# Altium schematic sheet 4USB.SchDoc
size A2
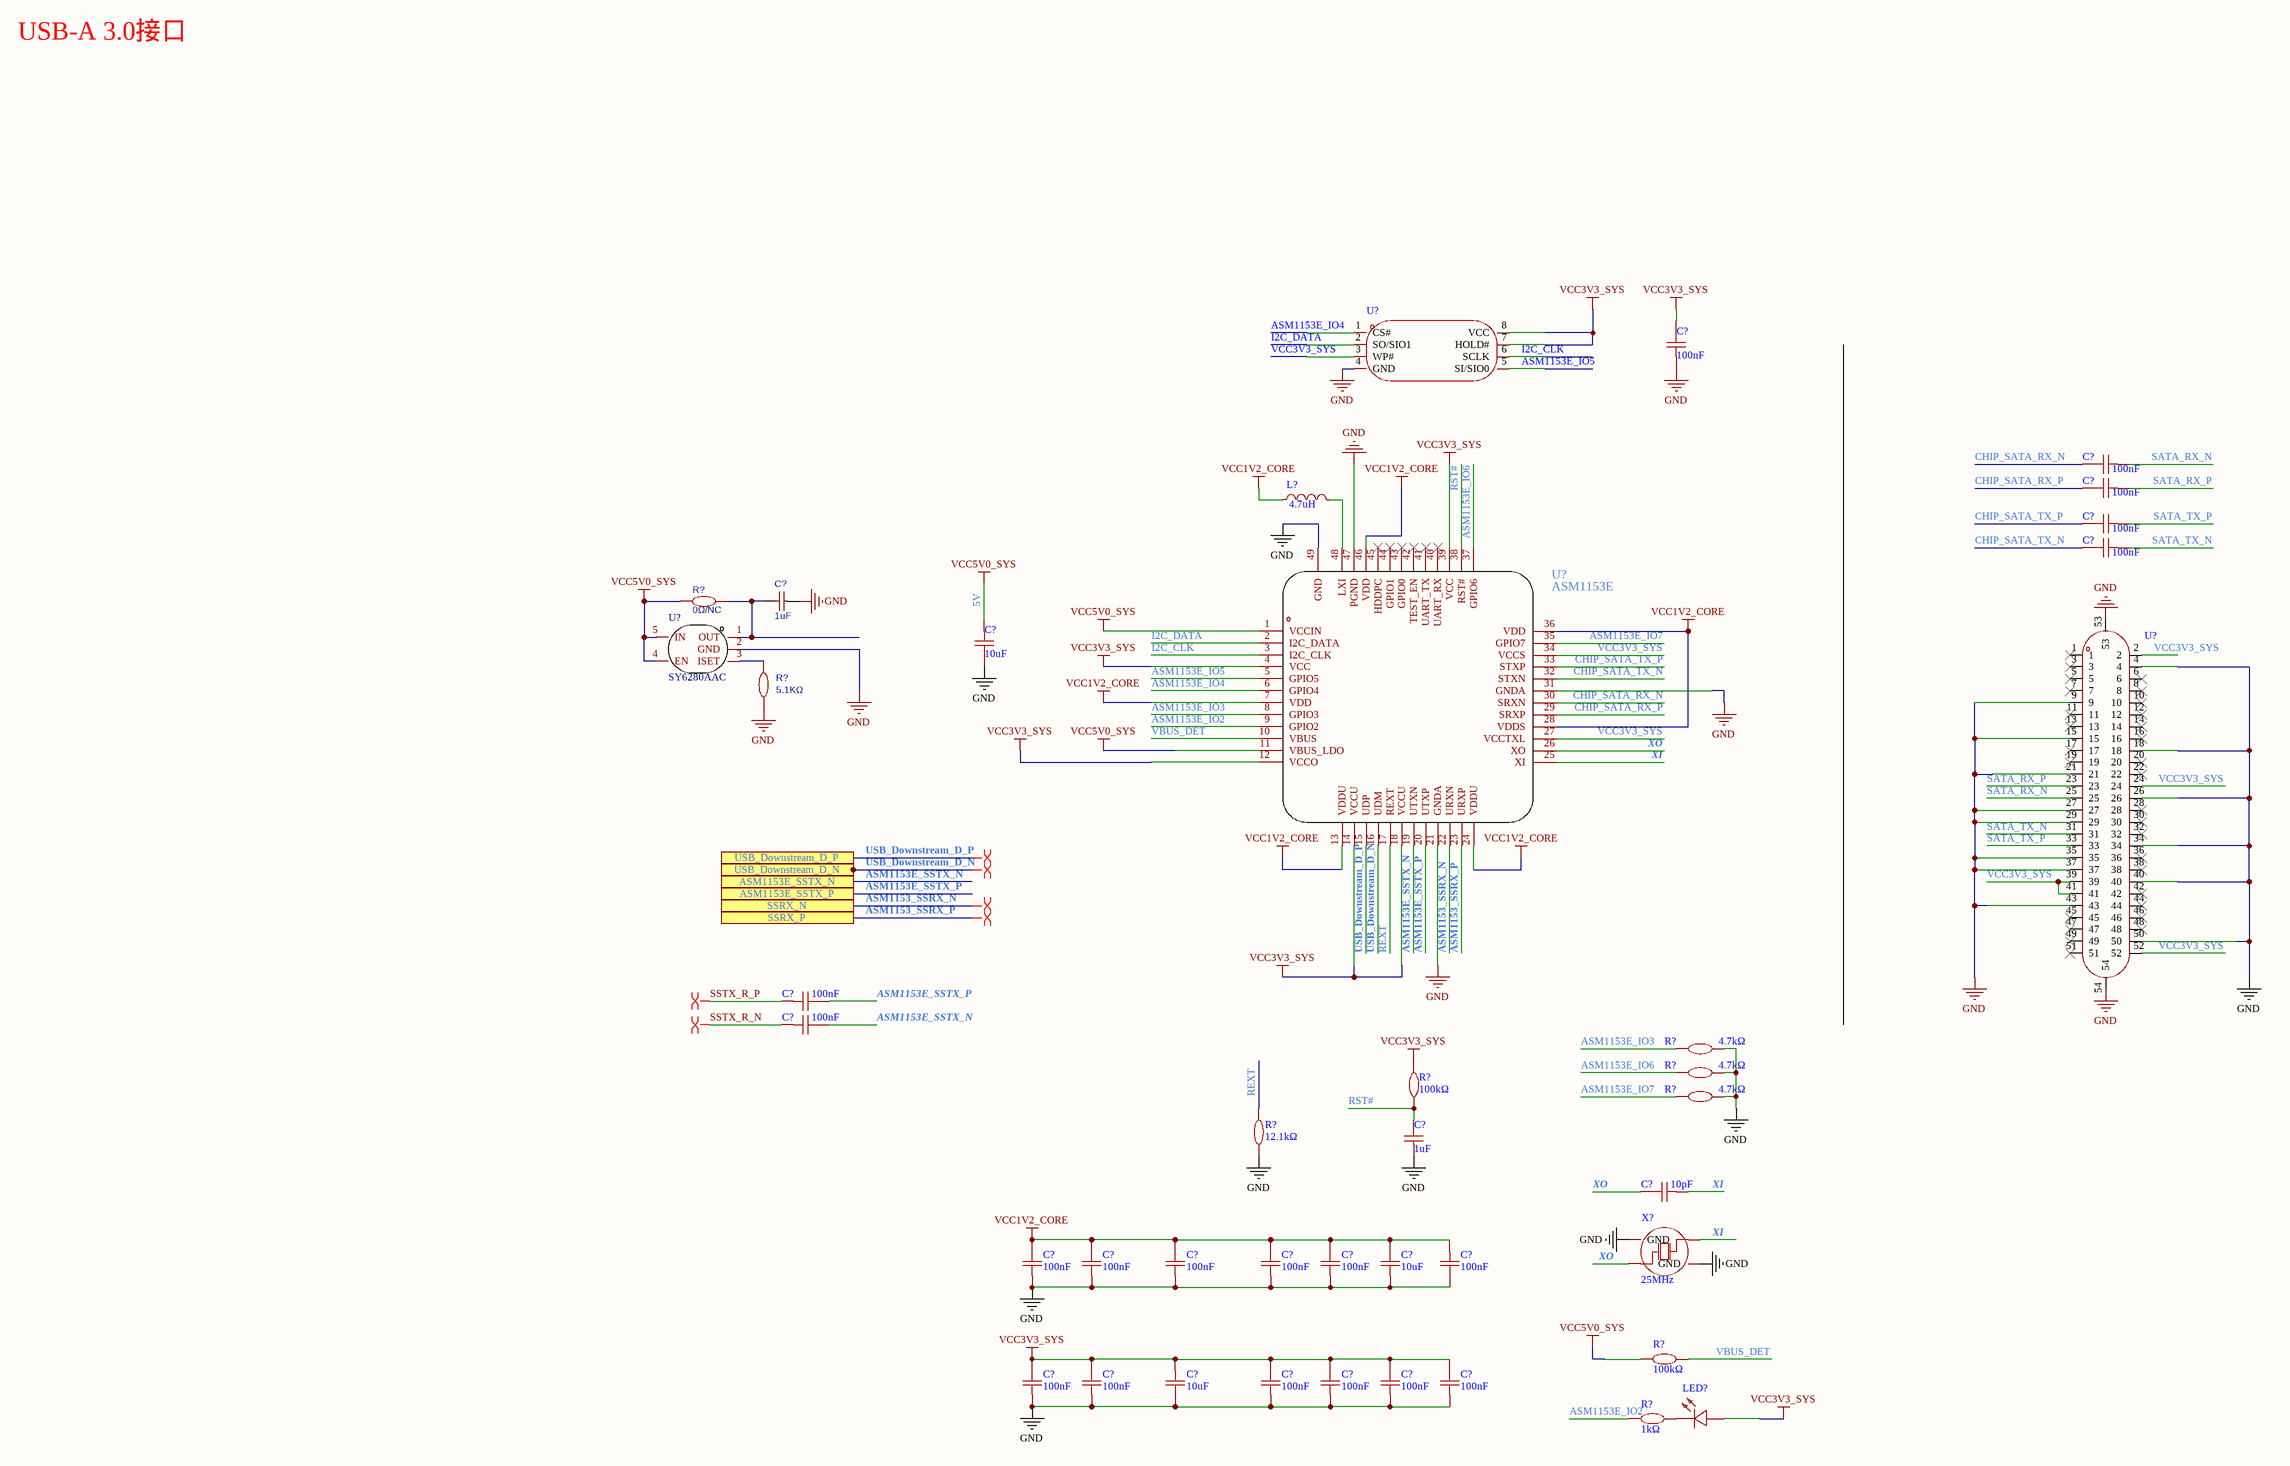
[diagram p0: 4USB.SchDoc]

## Parts
(Parts that share a designator on the sheet are numbered #1, #2 ... from top to bottom, then left to right.)
C?#1  100nF  [C0402]
C?#2  100nF  [C0402]
C?#3  100nF  [C0402]
C?#4  100nF  [C0402]
C?#5  100nF  [C0402]
C?#6  1uF  [C0603]
C?#7  10uF  [C0603]
C?#8  100nF  [C0402]
C?#9  100nF  [C0402]
C?#10  1uF  [C0402]
C?#11  10pF  [C0402]
C?#12  100nF  [C0402]
C?#13  100nF  [C0402]
C?#14  100nF  [C0402]
C?#15  100nF  [C0402]
C?#16  100nF  [C0402]
C?#17  10uF  [C0603]
C?#18  100nF  [C0402]
C?#19  100nF  [C0402]
C?#20  100nF  [C0402]
C?#21  10uF  [C0603]
C?#22  100nF  [C0402]
C?#23  100nF  [C0402]
C?#24  100nF  [C0402]
C?#25  100nF  [C0402]
L?  4.7uH  [IND-SMD_L3.0-W3.0-1]
LED?  VLMW1500-GS08  [LED0402-R-RD_WHITE]  (value not drawn)
R?#1  0Ω/NC  [R0603]
R?#2  5.1KΩ  [R0603]
R?#3  4.7kΩ  [R0402]
R?#4  4.7kΩ  [R0402]
R?#5  100kΩ  [R0402]
R?#6  4.7kΩ  [R0402]
R?#7  12.1kΩ  [R0402]
R?#8  100kΩ  [R0402]
R?#9  1kΩ  [R0402]
U?#1  MX25L512EMI-10G  [SOP-8_L5.0-W4.0-P1.27-LS6.0-BL]  (value not drawn)
U?#2  SY6280AAC  [SOT-23-5_L3.0-W1.7-P0.95-LS2.8-BR]
U?#3  PCIE-52P70H  [PCIE-SMD_52P-P0.80_PCIE-52PXXH]  (value not drawn)
U?#4  ASM1153E  [QFN-48_L6.0-W6.0-P0.40-BL-EP4.2]
X?  25MHz  [CRYSTAL-SMD_4P-L3.2-W2.5-BL]

## Ports
ASM1153E_SSTX_N, ASM1153E_SSTX_P, SSRX_N, SSRX_P, USB_Downstream_D_N, USB_Downstream_D_P

## Nets
5V: C?#7.2 R?#1.1 R?#8.1 U?#2.4(EN) U?#2.5(IN) U?#4.1(VCCIN) U?#4.11(VBUS_LDO)  [also labelled VCC5V0_SYS]
GND: C?#1.2 C?#6.1 C?#7.1 C?#10.1 C?#12.2 C?#13.2 C?#14.2 C?#15.2 C?#16.2 C?#17.2 C?#18.1 C?#19.2 C?#20.2 C?#21.1 C?#22.2 C?#23.2 C?#24.2 C?#25.2 R?#2.2 R?#3.2 R?#4.2 R?#6.2 R?#7.1 U?#1.4(GND) U?#2.2(GND) U?#3.4 U?#3.9 U?#3.15 U?#3.18 U?#3.21 U?#3.26 U?#3.27 U?#3.29 U?#3.34 U?#3.35 U?#3.37 U?#3.40 U?#3.43 U?#3.50 U?#3.53 U?#3.54 U?#4.21(GNDA) U?#4.31(GNDA) U?#4.47(PGND) U?#4.49(GND) X?.2(GND) X?.4(GND)
VCC1V2_CORE: C?#12.1 C?#13.1 C?#14.1 C?#15.1 C?#16.1 C?#17.1 C?#18.2 L?.1 U?#4.7(VDD) U?#4.13(VDDU) U?#4.24(VDDU) U?#4.28(VDDS) U?#4.36(VDD) U?#4.46(VDD)
VCC3V3_SYS: C?#1.1 C?#19.1 C?#20.1 C?#21.2 C?#22.1 C?#23.1 C?#24.1 C?#25.1 LED?.1(A) R?#5.2 U?#1.3(WP#) U?#1.7(HOLD#) U?#1.8(VCC) U?#3.2 U?#3.24 U?#3.39 U?#3.41 U?#3.52 U?#4.4(VCC) U?#4.12(VCCO) U?#4.14(VCCU) U?#4.18(VCCU) U?#4.27(VCCTXL) U?#4.34(VCCS) U?#4.39(VCC)
ASM1153_SSRX_N: U?#4.22(URXN) ; port SSRX_N
ASM1153_SSRX_P: U?#4.23(URXP) ; port SSRX_P
ASM1153E_IO2: R?#9.1 U?#4.9(GPIO2)
ASM1153E_IO3: R?#3.1 U?#4.8(GPIO3)
ASM1153E_IO4: U?#1.1(CS#) U?#4.6(GPIO4)
ASM1153E_IO5: U?#1.5(SI/SIO0) U?#4.5(GPIO5)
ASM1153E_IO6: R?#4.1 U?#4.37(GPIO6)
ASM1153E_IO7: R?#6.1 U?#4.35(GPIO7)
ASM1153E_SSTX_N: C?#9.1 U?#4.19(UTXN) ; port ASM1153E_SSTX_N
ASM1153E_SSTX_P: C?#8.1 U?#4.20(UTXP) ; port ASM1153E_SSTX_P
CHIP_SATA_RX_N: C?#2.1 U?#4.30(SRXN)
CHIP_SATA_RX_P: C?#3.1 U?#4.29(SRXP)
CHIP_SATA_TX_N: C?#5.1 U?#4.32(STXN)
CHIP_SATA_TX_P: C?#4.1 U?#4.33(STXP)
I2C_CLK: U?#1.6(SCLK) U?#4.3(I2C_CLK)
I2C_DATA: U?#1.2(SO/SIO1) U?#4.2(I2C_DATA)
REXT: R?#7.2 U?#4.17(REXT)
RST#: C?#10.2 R?#5.1 U?#4.38(RST#)
SATA_RX_N: C?#2.2 U?#3.25
SATA_RX_P: C?#3.2 U?#3.23
SATA_TX_N: C?#5.2 U?#3.31
SATA_TX_P: C?#4.2 U?#3.33
SSTX_R_N: C?#9.2
SSTX_R_P: C?#8.2
USB_Downstream_D_N: U?#4.16(UDM) ; port USB_Downstream_D_N
USB_Downstream_D_P: U?#4.15(UDP) ; port USB_Downstream_D_P
VBUS_DET: R?#8.2 U?#4.10(VBUS)
XI: C?#11.2 U?#4.25(XI) X?.3(OSC2)
XO: C?#11.1 U?#4.26(XO) X?.1(OSC1)
NetC?#6_2: C?#6.2 R?#1.2 U?#2.1(OUT)
NetL?_2: L?.2 U?#4.48(LXI)
NetLED?_2: LED?.2(K) R?#9.2
NetR?#2_1: R?#2.1 U?#2.3(ISET)

Not connected (* = marked no-connect by the designer): U?#3 1* 3* 5* 6* 7* 8* 10* 11* 12* 13* 14* 16* 17* 19* 20* 22* 28* 30* 32* 36* 38* 42* 44* 45* 46* 47* 48* 49* 51*; U?#4 40(UART_RX)* 41(UART_TX)* 42(TEST_EN)* 43(GPIO0)* 44(GPIO1)* 45(HDDPC)*

## Layout directives
differential pair: ASM1153_SSRX_N, ASM1153_SSRX_P, SSTX_R_N, SSTX_R_P, USB_Downstream_D_N, USB_Downstream_D_P

## Notes on the sheet
- USB-A 3.0接口

## Library data of the parts
C?#1-C?#5 C?#8 C?#9 C?#12-C?#16 C?#18-C?#20 C?#22-C?#25 = TCC0402X5R104M250AT: Manufacturer: CCTC(三环); Add into BOM: yes; Tolerance: ±20%; Voltage Rated: 25V; Temperature Coefficient: X5R; Symbol: TCC0402X5R104M250AT; Device: TCC0402X5R104M250AT; LCSC Part Name: 100nF ±20% 25V; Supplier Part: C359190; Manufacturer Part: TCC0402X5R104M250AT; Supplier Footprint: 0402; JLCPCB Part Class: Extended Part; Datasheet: https://atta.szlcsc.com/upload/public/pdf/source/20190103/C359190_40860758378AF13613616C0AB9EED028.pdf; Supplier: LCSC; Convert to PCB: yes; Value: 100nF
C?#6 = C: BOM_Manufacturer: FH; BOM_Manufacturer Part: 0603F104M500NT; nameAlias: Capacitance; BOM_Supplier: LCSC; BOM_Supplier Part: C42998; BOM_JLCPCB Part Class: Extended Part; spicePre: C; spiceSymbolName: 0603F104M500NT
C?#7 C?#17 C?#21 = CL10A106KP8NNNC: Manufacturer: SAMSUNG(三星); Add into BOM: yes; Tolerance: ±10%; Voltage Rated: 10V; Temperature Coefficient: X5R; Symbol: CL10A106KP8NNNC; Device: CL10A106KP8NNNC; LCSC Part Name: 10uF ±10% 10V; Supplier Part: C19702; Manufacturer Part: CL10A106KP8NNNC; Supplier Footprint: 0603; JLCPCB Part Class: Basic Part; Datasheet: https://atta.szlcsc.com/upload/public/pdf/source/20160103/1457707703378.pdf; Supplier: LCSC; Convert to PCB: yes; Value: 10uF
C?#10 = CL05A105KP5NNNC: Manufacturer: SAMSUNG(三星); Add into BOM: yes; Tolerance: ±10%; Voltage Rated: 10V; Temperature Coefficient: X5R; Symbol: CL05A105KP5NNNC; Device: CL05A105KP5NNNC; LCSC Part Name: 1uF ±10% 10V; Supplier Part: C14445; Manufacturer Part: CL05A105KP5NNNC; Supplier Footprint: 0402; JLCPCB Part Class: Extended Part; Datasheet: https://atta.szlcsc.com/upload/public/pdf/source/20160103/1457707670698.pdf; Supplier: LCSC; Convert to PCB: yes; Value: 1uF
C?#11 = TCC0402COG100J500AT: Manufacturer: CCTC(三环); Add into BOM: yes; Tolerance: ±5%; Voltage Rated: 50V; Temperature Coefficient: C0G; Symbol: TCC0402COG100J500AT; Device: TCC0402COG100J500AT; LCSC Part Name: 10pF ±5% 50V; Supplier Part: C696913; Manufacturer Part: TCC0402COG100J500AT; Supplier Footprint: 0402; JLCPCB Part Class: Extended Part; Datasheet: https://atta.szlcsc.com/upload/public/pdf/source/20200707/C696841_89A2C111301AB76AE7642008585E7A11.pdf; Supplier: LCSC; Convert to PCB: yes; Value: 10pF
L? = CKCS3012-4.7uH/M: Manufacturer: CENKER(岑科); Add into BOM: yes; Tolerance: ±20%; Rated Current: 1.24A; DC Resistance (DCR): 120mΩ; Symbol: CKCS3012-4.7UH/M; Device: CKCS3012-4.7uH/M; LCSC Part Name: 4.7uH ±20% 1.24A 120mΩ; Supplier Part: C354557; Manufacturer Part: CKCS3012-4.7uH/M; Supplier Footprint: SMD; JLCPCB Part Class: Extended Part; Datasheet: https://atta.szlcsc.com/upload/public/pdf/source/20190115/C354557_61A3705615E4FADB9C94D2137EE09B6B.pdf; Supplier: LCSC; Convert to PCB: yes; Value: 4.7uH
LED? = VLMW1500-GS08: Manufacturer: VISHAY(威世); Add into BOM: yes; Emitted Color: 白灯; Forward Current: 5mA; Forward Voltage (VF): 2.9V; Luminous Intensity: 90mcd; Power Dissipation: 70mW; Symbol: VLMW1500-GS08; Device: VLMW1500-GS08; LCSC Part Name: 白灯; Supplier Part: C511379; Manufacturer Part: VLMW1500-GS08; Supplier Footprint: 0402; JLCPCB Part Class: Extended Part; Datasheet: https://atta.szlcsc.com/upload/public/pdf/source/20200408/C511379_C2F59698F604A60E2C48FD851172BBA0.pdf; Supplier: LCSC; Convert to PCB: yes; Diode Configuration: -; Lens Color: -; Dominant Wavelength: -; Peak Wavelength: -; Color Temperature: -; Luminous Flux (@25℃): -; Viewing Angle: -; Mounting Sytle: -; Operating Temperature: -30~+80
R?#1 R?#2 = R: BOM_Manufacturer: Guangdong Fenghua Advanced Tech; BOM_Manufacturer Part: RS-03K1002FT; Resistance (Ohms): 10K; nameAlias: Resistance; Contributor: LCSC; BOM_Supplier: LCSC; BOM_Supplier Part: C115324; spicePre: R; spiceSymbolName: RS-03K1002FT
R?#3 R?#4 R?#6 = 0402WGJ0472TCE: Manufacturer: UNI-ROYAL(厚声); Add into BOM: yes; Tolerance: ±5%; Power(Watts): 1/16W; Temperature Coefficient: ±100ppm/; Overload Voltage (Max): 50V; Symbol: 0402WGJ0472TCE; Device: 0402WGJ0472TCE; LCSC Part Name: 4.7kΩ ±5%; Supplier Part: C25940; Manufacturer Part: 0402WGJ0472TCE; Supplier Footprint: 0402; JLCPCB Part Class: Extended Part; Datasheet: https://atta.szlcsc.com/upload/public/pdf/source/20200306/C422600_1E6D84923E4A46A82E41ADD87F860B5C.pdf; Supplier: LCSC; Convert to PCB: yes; Type: 厚膜电阻; Value: 4.7kΩ; Operating Temperature Range: -55~+155
R?#5 R?#8 = CR0402JF0104G: Manufacturer: LIZ(丽智电子); Add into BOM: yes; Tolerance: ±5%; Power(Watts): 62.5mW; Temperature Coefficient: ±200ppm/; Overload Voltage (Max): 50V; Symbol: CR0402JF0104G; Device: CR0402JF0104G; LCSC Part Name: 100kΩ ±5% 62.5mW; Supplier Part: C100573; Manufacturer Part: CR0402JF0104G; Supplier Footprint: 0402; JLCPCB Part Class: Extended Part; Datasheet: https://atta.szlcsc.com/upload/public/pdf/source/20170408/1491631220702.pdf; Supplier: LCSC; Convert to PCB: yes; Type: 厚膜电阻; Value: 100kΩ; Operating Temperature Range: -55~+125
R?#7 = RC-02W1212FT: Manufacturer: FH(风华); Add into BOM: yes; Tolerance: ±1%; Power(Watts): 62.5mW; Temperature Coefficient: ±200ppm/; Overload Voltage (Max): 50V; Symbol: RC-02W1212FT; Device: RC-02W1212FT; LCSC Part Name: 12.1kΩ ±1% 62.5mW; Supplier Part: C321280; Manufacturer Part: RC-02W1212FT; Supplier Footprint: 0402; JLCPCB Part Class: Extended Part; Datasheet: https://atta.szlcsc.com/upload/public/pdf/source/20181129/C321280_9F126374E01D2C505D3C2BDB1D16BD85.pdf; Supplier: LCSC; Convert to PCB: yes; Value: 12.1kΩ; Operating Temperature Range: -55~+155
R?#9 = RC-02K102JT: Manufacturer: FH(风华); Symbol: RS-02K102JT; Add into BOM: yes; Tolerance: ±5%; Power(Watts): 62.5mW; Temperature Coefficient: ±100ppm/; Overload Voltage (Max): 50V; Device: RC-02K102JT; LCSC Part Name: 1kΩ ±5% 62.5mW; Supplier Part: C140196; Manufacturer Part: RC-02K102JT; Supplier Footprint: 0402; JLCPCB Part Class: Extended Part; Datasheet: https://atta.szlcsc.com/upload/public/pdf/source/20171106/C140196_15099446043381092285.pdf; Supplier: LCSC; Convert to PCB: yes; Value: 1kΩ; Operating Temperature Range: -55~+155
U?#1 = MX25L512EMI-10G: Manufacturer: MXIC(旺宏电子); Symbol: MX25L512EMI-10G_C2803023; Add into BOM: yes; Device: MX25L512EMI-10G; LCSC Part Name: MX25L512EMI-10G; Supplier Part: C2803023; Manufacturer Part: MX25L512EMI-10G; Supplier Footprint: SOP-8; JLCPCB Part Class: Extended Part; Datasheet: https://atta.szlcsc.com/upload/public/pdf/source/20210906/B454D1B9C39ED3C00F3164A690CF7DD8.pdf; Supplier: LCSC; Convert to PCB: yes
U?#3 = PCIE-52P70H: Manufacturer: XUNPU(讯普); Symbol: PCIE-52P70H_C2982554; Add into BOM: yes; Device: PCIE-52P70H; LCSC Part Name: PCIE-52P70H; Supplier Part: C2982554; Manufacturer Part: PCIE-52P70H; Supplier Footprint: SMD; JLCPCB Part Class: Extended Part; Datasheet: https://atta.szlcsc.com/upload/public/pdf/source/20220311/DC8B167F9A8E29C645B8AA97E9059897.pdf; Supplier: LCSC; Convert to PCB: yes
U?#4 = ASM1153E: USB3.0 to SATA Bridge Controller; Add into BOM: yes; Symbol: ASM1153E; Device: ASM1153E; LCSC Part Name: ASM1153E; Supplier Part: C2762919; Manufacturer Part: ASM1153E; Supplier Footprint: LQFN-48_EP_6.0x6.0x0.4P; JLCPCB Part Class: Extended Part; Datasheet: 2021-03-22/601605W/2276bd4a79cf4165b237c0c17b58d9ef/ASM1153Datasheetv1_1.pdf; Supplier: LCSC; Convert to PCB: yes
X? = X1E0000210621: Manufacturer: EPSON(爱普生); Add into BOM: yes; Crystal Type: 贴片无源晶振; Frequency Tolerance: ±10ppm; Load Capacitance: 9pF; Equivalent Series Resistance (ESR): 40Ω; Symbol: X1E0000210621; Device: X1E0000210621; LCSC Part Name: 25MHz ±10ppm 9pF; Supplier Part: C255920; Manufacturer Part: X1E0000210621; Supplier Footprint: SMD3225-4P; JLCPCB Part Class: Extended Part; Datasheet: https://atta.szlcsc.com/upload/public/pdf/source/20180822/C255920_F9528E19433D1B377CB88CCBF483E490.pdf; Supplier: LCSC; Convert to PCB: yes; Value: 25MHz; Frequency Stability: -; Operating Temperature: -40~+85